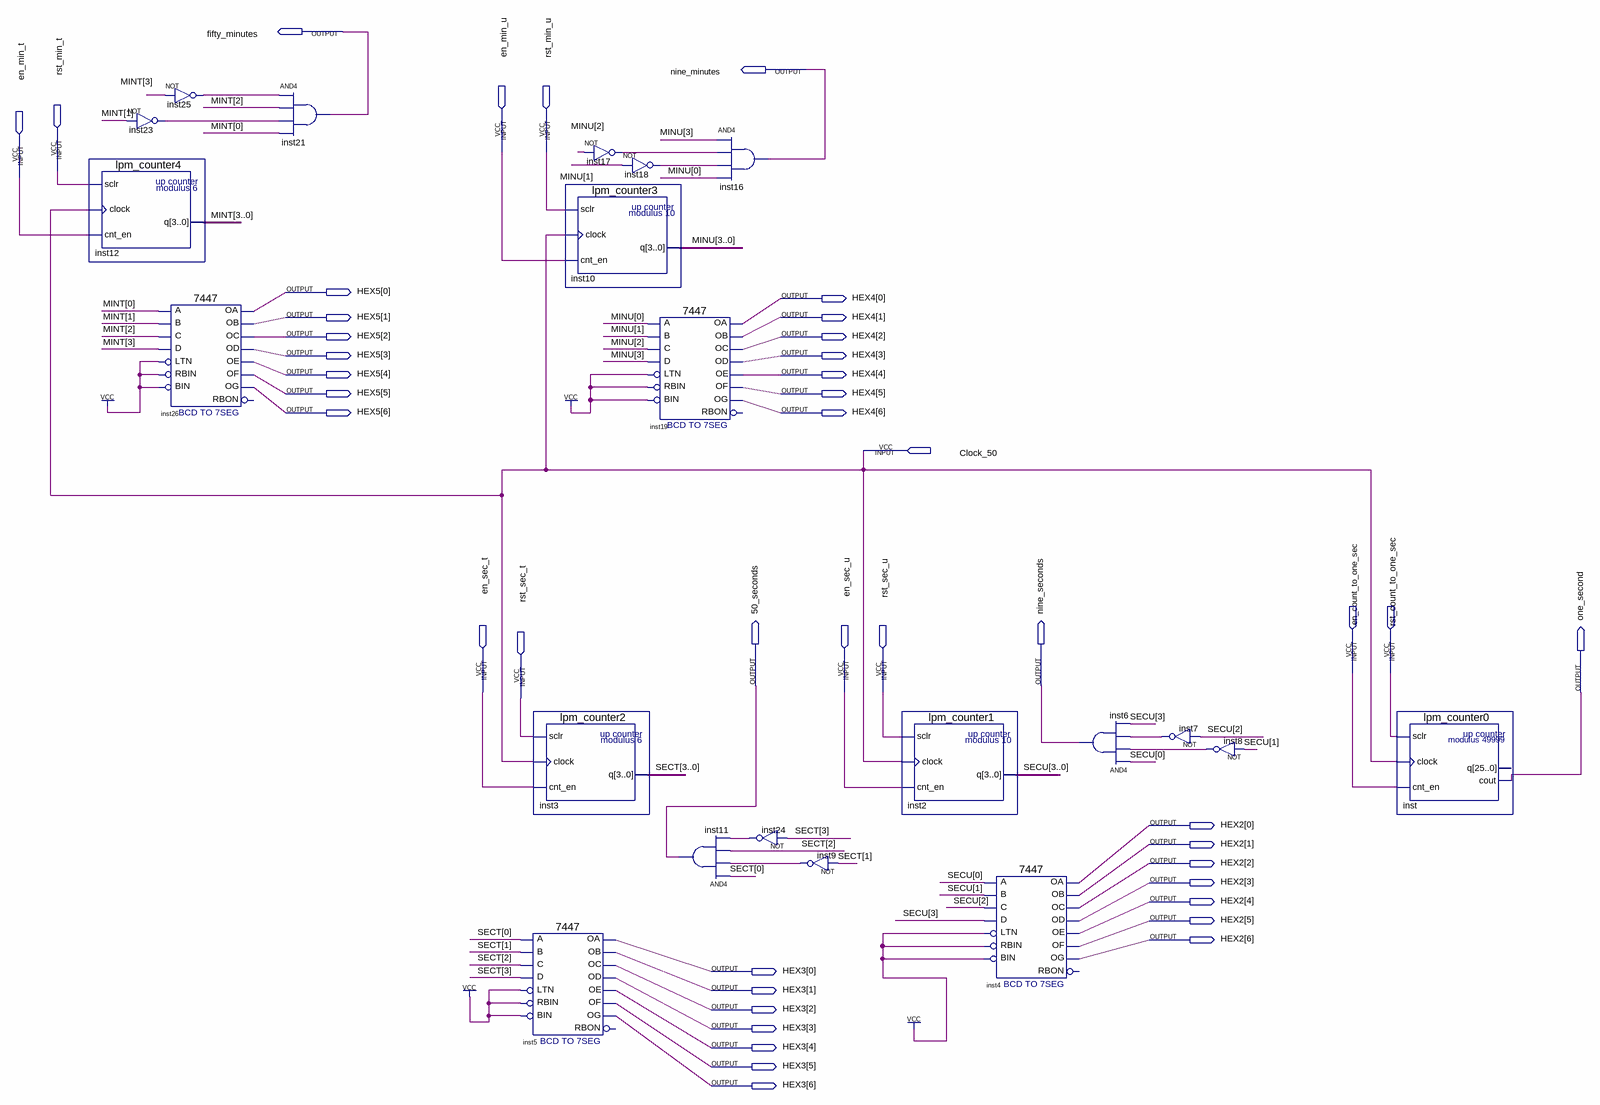
[diagram p0: schematic sheet]
// Quartus schematic Block.bdf as structural Verilog: 21 symbols, 44 pins
module Block (
  input  en_min_u,
  input  rst_min_u,
  input  rst_min_t,
  input  en_min_t,
  input  Clock_50,
  input  en_count_to_one_sec,
  input  rst_count_to_one_sec,
  input  en_sec_t,
  input  en_sec_u,
  input  rst_sec_u,
  input  rst_sec_t,
  output fifty_minutes,
  output nine_minutes,
  output [6:0] HEX5,
  output [6:0] HEX4,
  output \50_seconds ,
  output nine_seconds,
  output one_second,
  output [6:0] HEX2,
  output [6:0] HEX3
);

  wire inst7_out, inst8_out, inst9_out, inst17_out, inst18_out, inst23_out, inst24_out, inst25_out;
  wire [3:0] MINT, MINU, SECT, SECU;

  lpm_counter4 inst12 (.sclr(rst_min_t), .clock(Clock_50), .cnt_en(en_min_t), .q(MINT));
  not inst23 (inst23_out, MINT[1]);
  \7447  inst26 (
    .LTN(1'b1), .B(MINT[1]), .C(MINT[2]), .D(MINT[3]), .RBIN(1'b1), .BIN(1'b1), .A(MINT[0]), .OB(HEX5[1]),
    .OC(HEX5[2]), .OE(HEX5[4]), .OD(HEX5[3]), .OF(HEX5[5]), .OG(HEX5[6]), .OA(HEX5[0]));  // open: RBON
  not inst25 (inst25_out, MINT[3]);
  and inst21 (fifty_minutes, inst25_out, MINT[2], inst23_out, MINT[0]);
  lpm_counter3 inst10 (.sclr(rst_min_u), .clock(Clock_50), .cnt_en(en_min_u), .q(MINU));
  lpm_counter2 inst3 (.sclr(rst_sec_t), .clock(Clock_50), .cnt_en(en_sec_t), .q(SECT));
  \7447  inst5 (
    .LTN(1'b1), .B(SECT[1]), .C(SECT[2]), .D(SECT[3]), .RBIN(1'b1), .BIN(1'b1), .A(SECT[0]), .OB(HEX3[1]),
    .OC(HEX3[2]), .OE(HEX3[4]), .OD(HEX3[3]), .OF(HEX3[5]), .OG(HEX3[6]), .OA(HEX3[0]));  // open: RBON
  not inst17 (inst17_out, MINU[2]);
  not inst18 (inst18_out, MINU[1]);
  \7447  inst19 (
    .LTN(1'b1), .B(MINU[1]), .C(MINU[2]), .D(MINU[3]), .RBIN(1'b1), .BIN(1'b1), .A(MINU[0]), .OB(HEX4[1]),
    .OC(HEX4[2]), .OE(HEX4[4]), .OD(HEX4[3]), .OF(HEX4[5]), .OG(HEX4[6]), .OA(HEX4[0]));  // open: RBON
  and inst16 (nine_minutes, MINU[3], inst17_out, inst18_out, MINU[0]);
  and inst11 (\50_seconds , SECT[0], inst9_out, SECT[2], inst24_out);
  not inst24 (inst24_out, SECT[3]);
  not inst9 (inst9_out, SECT[1]);
  lpm_counter1 inst2 (.sclr(rst_sec_u), .clock(Clock_50), .cnt_en(en_sec_u), .q(SECU));
  \7447  inst4 (
    .LTN(1'b1), .B(SECU[1]), .C(SECU[2]), .D(SECU[3]), .RBIN(1'b1), .BIN(1'b1), .A(SECU[0]), .OB(HEX2[1]),
    .OC(HEX2[2]), .OE(HEX2[4]), .OD(HEX2[3]), .OF(HEX2[5]), .OG(HEX2[6]), .OA(HEX2[0]));  // open: RBON
  and inst6 (nine_seconds, SECU[0], inst8_out, inst7_out, SECU[3]);
  not inst7 (inst7_out, SECU[2]);
  not inst8 (inst8_out, SECU[1]);
  lpm_counter0 inst (
    .sclr(rst_count_to_one_sec), .clock(Clock_50), .cnt_en(en_count_to_one_sec), .cout(one_second));  // open: q
endmodule
